# Altium schematic sheet Extra Analogue Inputs.SchDoc: RB25DET - Extra Analogue Inputs
size A4; Address1: Drawn By:; Address2: Dan Visser; DocumentNumber: A; Revision: 0.1; SheetNumber: 5; SheetTotal: 12
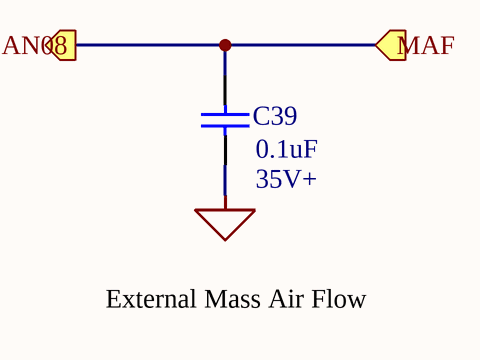
[diagram p0: Extra Analogue Inputs.SchDoc]

## Parts
C39  value 0.1uF  [RAD-0.3]

## Ports
AN08 (out), MAF (in)

## Nets
AN08: C39.2 ; port AN08, port MAF

Not connected (* = marked no-connect by the designer): C39 1

## Notes on the sheet
- (near C39) 35V+
- External Mass Air Flow
- Title
- Size:
- Date:
- A4
- Number:
- Time:
- Revision:
- Sheet
- of

## Library data of the parts
C39 = Cap: Capacitor; Published: 8-Jun-2000; LatestRevisionDate: 17-Jul-2002; LatestRevisionNote: Re-released for DXP Platform.; PackageReference: RAD-0.3; Publisher: Altium Limited; PackageDescription: Radial Cap, Thru-Hole; 2 Leads; 0.3 in Pin Spacing